# EAGLE design Stepper Test (EAGLE 9.0.0)
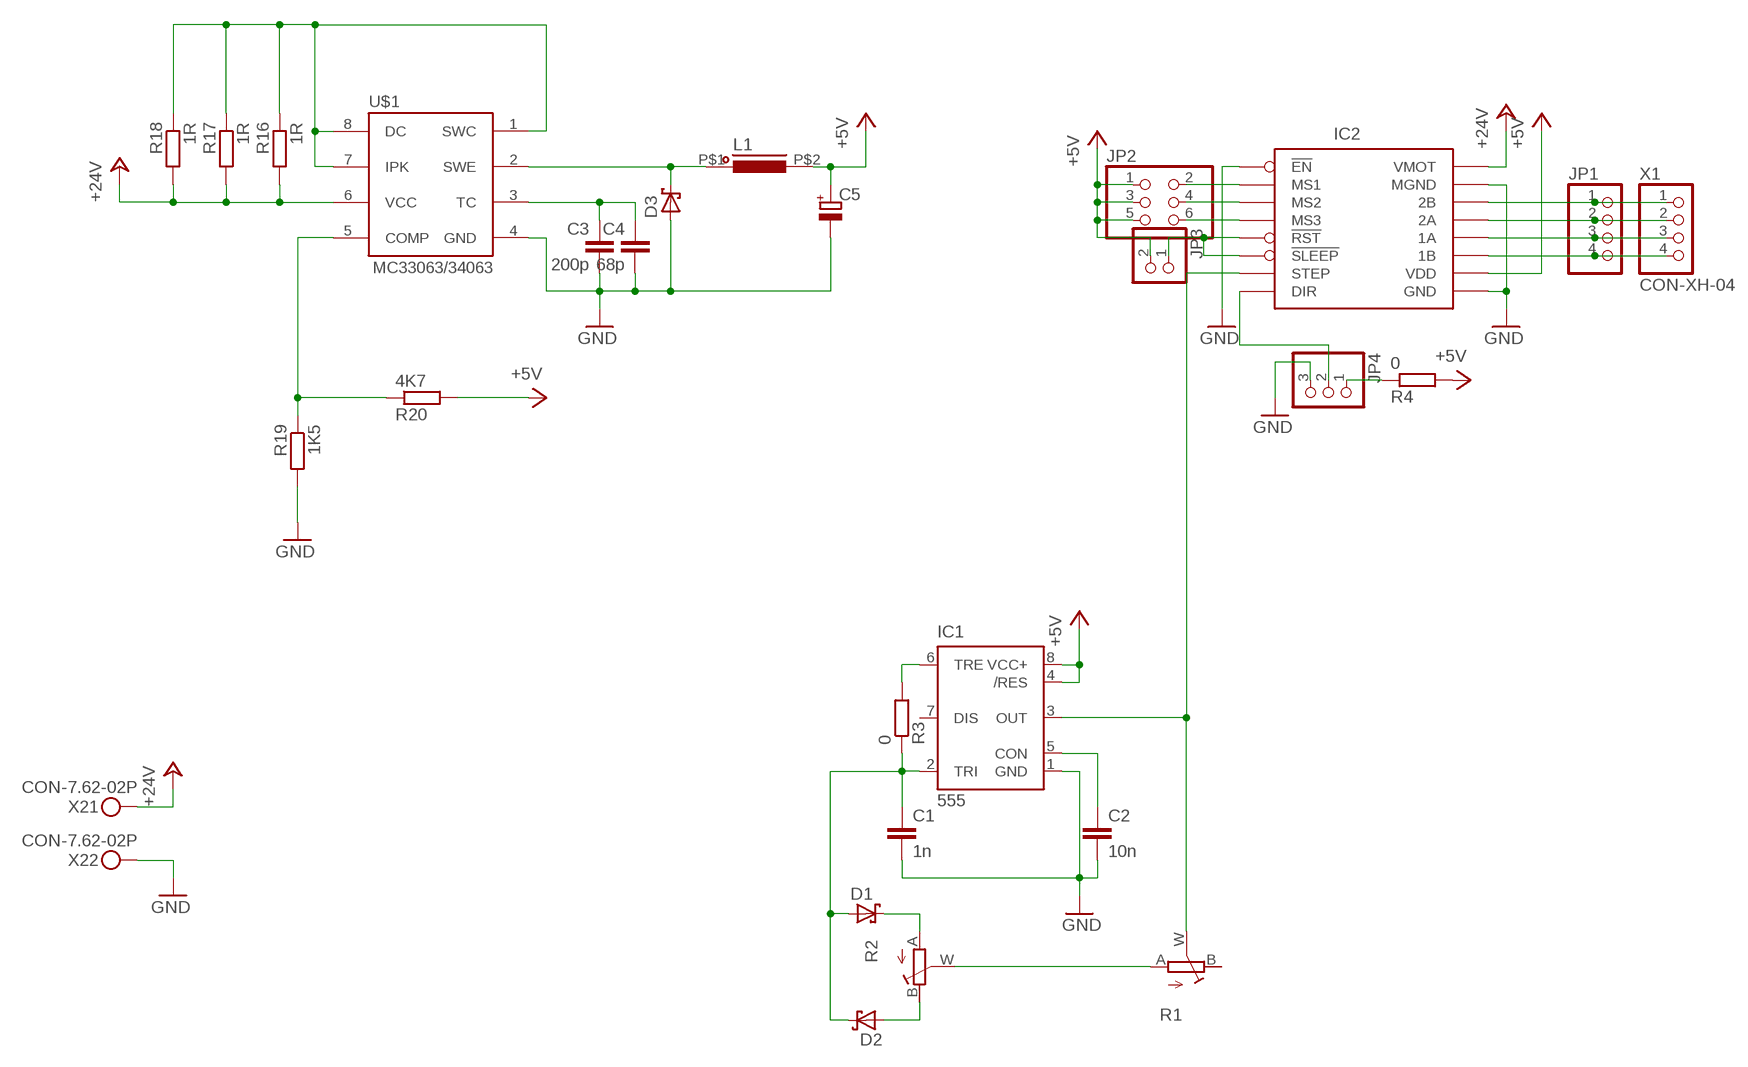
[diagram p0: schematic, sheet 1]

## Parts
C1  1n  CAP_0805  [C0805]
C2  10n  CAP_0805  [C0805]
C3  200p  CAP_0805  [C0805]
C4  68p  CAP_0805  [C0805]
C5  CAP-POL_E3.5-8  [E3,5-8]
D1  DIODE-SH_SOD523  [SOD523]
D2  DIODE-SH_SOD523  [SOD523]
D3  DIODE-SH_SMA  [DO214AC]
IC1  555  555D  [SO08]
IC2  STEP-DRV  [DRV-BRK]
JP1  PINHD-1X4  [1X04]
JP2  PINHD-2X3  [2X03]
JP3  PINHD-1X2  [1X02]
JP4  PINHD-1X3  [1X03]
L1  INDUCTORCW68  [CW68]
R1  R_POTTURN-X  [RJ9W]
R2  R_POTTURN-X  [RJ9W]
R3  0  R_0805  [R0805]
R4  0  R_0805  [R0805]
R16  1R  R_0805  [R0805]
R17  1R  R_0805  [R0805]
R18  1R  R_0805  [R0805]
R19  1K5  R_0805  [R0805]
R20  4K7  R_0805  [R0805]
U$1  MC33063/MC34063P  [DIL08]
X1  CON-XH-04  [XH-04]
X2  CON-7.62-02P  [KF25C-7.62-02P-13]

## Nets
+5V: C5.+ IC1.4(/RES) IC1.8(VCC+) IC2.P$10(VDD) JP2.1 JP2.3 JP2.5 JP3.2 L1.P$2 R4.2 R20.2
+24V: IC2.P$16(VMOT) R16.2 R17.2 R18.2 U$1.6(VCC) X2.P$1
GND: C1.2 C2.2 C3.2 C4.2 C5.- D3.A IC1.1(GND) IC2.P$1(!EN) IC2.P$9(GND) IC2.P$15(MGND) JP4.3 R19.2 U$1.4(GND) X2.P$2
N$1: C1.1 D1.A D2.C IC1.2(TRI) R3.1
N$2: IC2.P$14(2B) JP1.1 X1.1
N$3: C2.1 IC1.5(CON)
N$4: IC2.P$13(2A) JP1.2 X1.2
N$5: IC2.P$12(1A) JP1.3 X1.3
N$6: IC2.P$11(1B) JP1.4 X1.4
N$7: IC2.P$2(MS1) JP2.2
N$8: IC2.P$3(MS2) JP2.4
N$9: R1.A R2.W(S)
N$10: IC1.3(OUT) IC2.P$7(STEP) R1.W(S)
N$11: D1.C R2.A
N$12: D2.A R2.B(E)
N$13: IC2.P$4(MS3) JP2.6
N$14: IC2.P$5(!RST) IC2.P$6(!SLEEP) JP3.1
N$15: IC1.6(TRE) R3.2
N$16: IC2.P$8(DIR) JP4.2
N$17: JP4.1 R4.1
N$51: C3.1 C4.1 U$1.3(TC)
N$52: R16.1 R17.1 R18.1 U$1.1(SWC) U$1.7(IPK) U$1.8(DC)
N$54: D3.C L1.P$1 U$1.2(SWE)
N$55: R19.1 R20.1 U$1.5(COMP)
Unconnected: IC1.7(DIS) R1.B(E)

## Library data of the parts
C1 C2 = Flamberm:CAP_
C3 C4 = Namenlos:CAP_
C5 = Namenlos:CAP-POL_
D1 D2 = Flamberm:DIODE-SH_
D3 = Namenlos:DIODE-SH_
IC1 = SparkFun-IC-Special-Function:555: General purpose bipolar Timer Datasheet <http://www.sparkfun.com/datasheets/Components/General/ne555.pdf> SparkFun Products SparkFun SparkPunk Sequencer Kit <https://www.sparkfun.com/products/12707> (KIT-12707) Storefront Component: 555 Timer <https://www.sparkfun.com/products/9273> (COM-09273) Two parts valid for production: VFP: IC-11930 (M7555 PTH) VFP: IC-09173 (555 PTH) - Preferred; PROD_ID: NA-XXXXX
IC2 = Flamberm:STEP-DRV
JP1 = pinhead:PINHD-1X4: PIN HEADER
JP2 = pinhead:PINHD-2X3: PIN HEADER
JP3 = pinhead:PINHD-1X2: PIN HEADER
JP4 = pinhead:PINHD-1X3: PIN HEADER
L1 = Namenlos:INDUCTOR
R1 R2 = Flamberm:R_POT
R3 R4 R16-R20 = Namenlos:R_
U$1 = adafruit:MC33063/MC34063: MC33063 and MC34063 Basic DC/DC converter with internal power-NPN transistor, 100KHz, 1.5A peak switch current. 3-40 input/output.
X1 = Flamberm:CON-XH-04
X2 = Flamberm:CON-7.62-02P

## Board
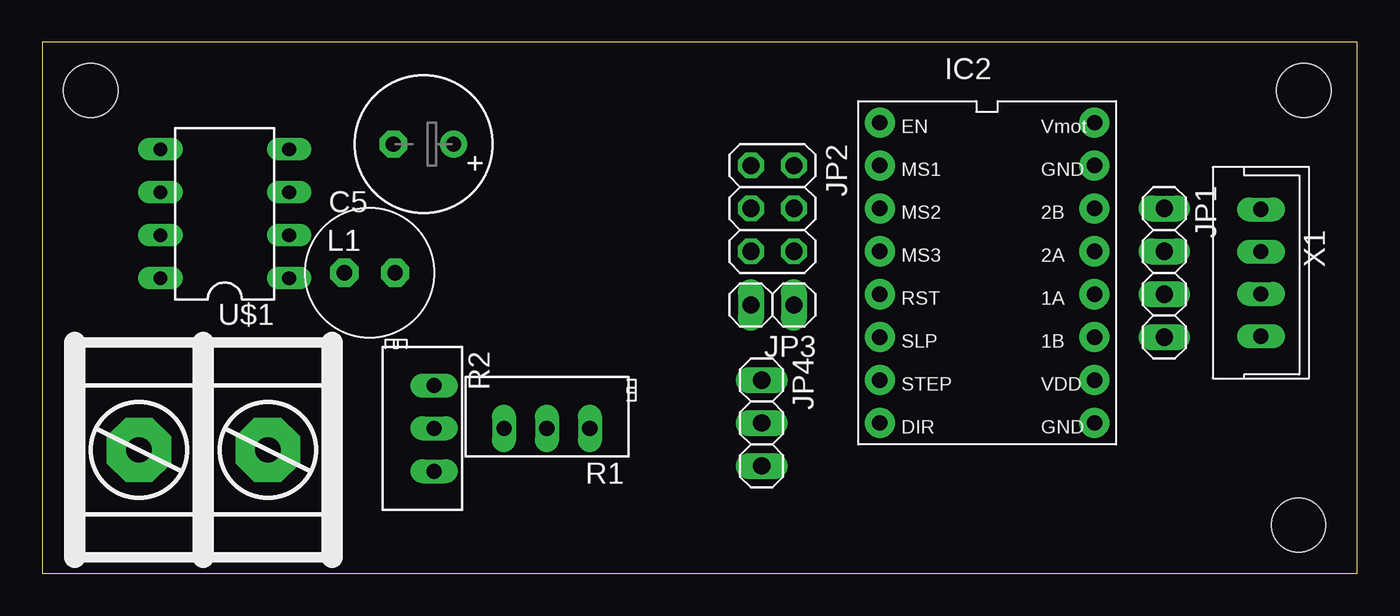
[diagram p1: board, top side]
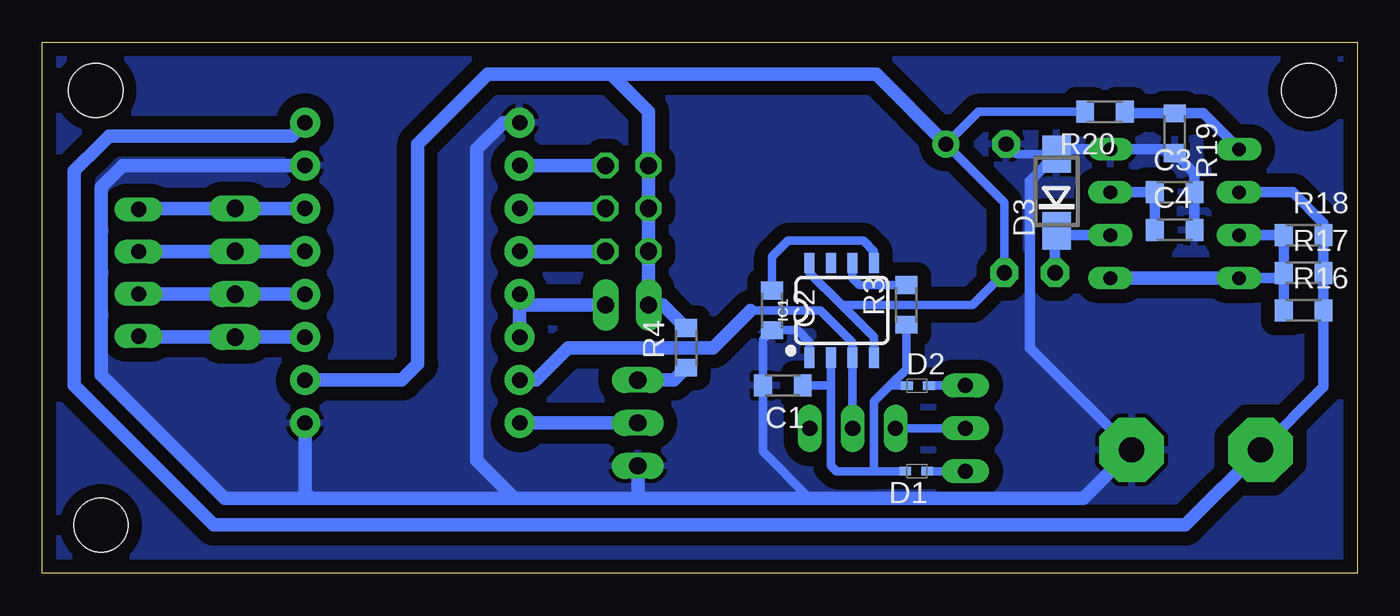
[diagram p2: board, bottom side, seen from below]

Size 77.77 x 31.42 mm. Coordinates in mm from the lower left corner, seen from the top.
Outline: 0,0 77.77,0 77.77,31.42 0,31.42 0,0
Copper layers (1*16): Top 0.035mm / dielectric 1.5mm / Bottom 0.035mm
Design rules "EagleDesignRules": minimum track width 0.25mm, minimum drill 0.3mm, track to track 0.25mm, track to pad 0.25mm, pad to pad 0.25mm, via to via 0.25mm, smd to smd 0.25mm, copper to edge 0.5mm, drill to drill 0.5mm, minimum pad ring 10mil, minimum via ring 8mil, stop-mask expansion 4mil, vias tented up to drill 0mil, thermal gap 0.25mm
Holes 3.2 mm at 74.61,28.57 2.86,28.57 74.3,2.86

### Footprints (pad centres in the part's own frame; a part is rotated, then mirrored left to right if it is on the bottom)
C0805 = smd 1.05 x 1.3: 1 -1.175,0; 2 1.175,0
E3,5-8 = drill 0.9 pad 1.6: + -1.778,0 | drill 0.9 pad 1.6 octagon: - 1.778,0
SOD523 = smd 0.7 x 0.5: A 0.7,0; C -0.6,0
DO214AC = smd 2.2 x 1.7: A 2.25,0; C -2.285,0
SO08 = smd 0.6 x 1.2: 1 -1.905,-2.8; 2 -0.635,-2.8; 3 0.635,-2.8; 4 1.905,-2.8; 5 1.905,2.8; 6 0.635,2.8; 7 -0.635,2.8; 8 -1.905,2.8
DRV-BRK = drill 0.9 pad 1.778: P$1 -8.89,-6.35; P$2 -6.35,-6.35; P$3 -3.81,-6.35; P$4 -1.27,-6.35; P$5 1.27,-6.35; P$6 3.81,-6.35; P$7 6.35,-6.35; P$8 8.89,-6.35; P$9 8.89,6.35; P$10 6.35,6.35; P$11 3.81,6.35; P$12 1.27,6.35; P$13 -1.27,6.35; P$14 -3.81,6.35; P$15 -6.35,6.35; P$16 -8.89,6.35
1X04 = drill 1.016 long: 1 -3.81,0; 2 -1.27,0; 3 1.27,0; 4 3.81,0
2X03 = drill 1.016 octagon: 1 -2.54,-1.27; 2 -2.54,1.27; 3 0,-1.27; 4 0,1.27; 5 2.54,-1.27; 6 2.54,1.27
1X02 = drill 1.016 long: 1 -1.27,0; 2 1.27,0
1X03 = drill 1.016 long: 1 -2.54,0; 2 0,0; 3 2.54,0
CW68 = drill 0.9 pad 1.676 octagon: P$1 -1.5,0; P$2 1.5,0
RJ9W = drill 0.9 long: A 2.54,0.635; B -2.54,0.635; W 0,0.635
R0805 = smd 1.05 x 1.3: 1 -1.175,0; 2 1.175,0
DIL08 = drill 0.813 long: 1 -3.81,-3.81; 2 -1.27,-3.81; 3 1.27,-3.81; 4 3.81,-3.81; 5 3.81,3.81; 6 1.27,3.81; 7 -1.27,3.81; 8 -3.81,3.81
XH-04 = drill 0.9 long: 1 -3.75,0; 2 -1.25,0; 3 1.25,0; 4 3.75,0
KF25C-7.62-02P-13 = drill 1.5 pad 3.81 octagon: P$1 -3.81,0; P$2 3.81,0

### Placement (x,y rotation side)
C1  33.97,11.11 180 bottom
C2  34.61,15.56 270 bottom
C3  10.79,22.54 0 bottom
C4  10.79,20.32 0 bottom
C5  22.54,25.4 180 top
D1  26.04,6.03 180 bottom
D2  26.04,11.11 0 bottom
D3  17.78,22.54 90 bottom
IC1  30.48,15.56 0 bottom
IC2  55.88,17.78 270 top
JP1  66.36,17.78 270 top
JP2  43.18,21.59 270 top
JP3  43.18,15.88 180 top
JP4  42.55,8.89 270 top
L1  19.37,17.78 0 top
R1  29.84,9.21 180 top
R2  22.54,8.57 270 top
R3  26.67,15.88 90 bottom
R4  39.69,13.34 90 bottom
R16  3.17,15.56 0 bottom
R17  3.17,17.78 0 bottom
R18  3.17,20 0 bottom
R19  10.79,26.04 270 bottom
R20  14.92,27.3 180 bottom
U$1  10.79,21.27 90 top
X1  72.07,17.78 270 top
X2  9.53,7.3 0 top

### Tracks (layer width: path | path; a pad name or v marks a point on that pad's centre or on a via)
+5V
  Bottom 0.508: R20.2 19.05,27.3 | 19.05,27.3 19.49,27.3 | 19.05,27.3 22.42,27.3 C5.+ 20.87,21.95 L1.P$2 22.77,15.88 30.48,15.88 | IC1.4 28.57,13.97 30.48,15.88 | IC1.8 32.38,17.78 30.48,15.88
  Bottom 0.813: IC2.P$10 56.52,11.43 55.56,12.38 55.56,25.4 51.44,29.53 44.13,29.53 | 44.13,29.53 41.91,27.3 JP2.1 JP2.3 JP2.5 JP3.2 41.05,15.88 R4.2 | 44.13,29.53 28.45,29.53 C5.+
+24V
  Bottom 0.61: X2.P$1 2,11.02 R16.2 R17.2 R18.2 2,20.73 3.81,22.54 U$1.6
  Bottom 0.813: X2.P$1 10.16,2.86 67.63,2.86 75.88,11.11 75.88,23.81 74.3,25.4 73.82,25.88 63.02,25.88 IC2.P$16
GND
  Bottom 0.508: IC1.1 32.38,13.65 33.12,14.38 33.34,14.38 C2.2 35.15,13.84 C1.2 35.15,7.21 32.38,4.45 | C5.- 20.16,24.79 D3.A
  Bottom 0.61: C4.2 C3.2 9.62,23.68 R19.2 11.02,25.08 U$1.4 17.49,25.08 D3.A 19.37,23.2 19.37,13.34 X2.P$2
  Bottom 0.813: X2.P$2 16.19,4.45 32.38,4.45 42.55,4.45 | 42.55,4.45 49.85,4.45 | 49.85,4.45 52.07,6.67 52.07,25.08 50.48,26.67 IC2.P$1 | JP4.3 42.55,4.45 | IC2.P$15 73.03,24.13 74.3,22.86 74.3,11.75 66.99,4.45 61.91,4.45 | 49.85,4.45 61.91,4.45 | IC2.P$9 62.23,4.76 61.91,4.45
  pour Bottom (isolate 0.813): 0,31.43 77.79,31.43 77.79,0 0,0
N$1
  Bottom 0.508: IC1.2 31.11,11.11 | 31.11,11.11 31.11,10.89 | D1.A 28.57,6.03 | D2.C 27.62,11.11 | 27.62,11.11 28.57,10.16 28.57,6.03 | 31.11,11.11 31.11,6.35 30.8,6.03 28.57,6.03 | C1.1 31.11,11.11 | R3.1 26.67,12.06 27.62,11.11
N$2
  Bottom 0.813: X1.1 72.01,21.59 JP1.1 IC2.P$14
N$3
  Bottom 0.508: C2.1 34.61,18.73 33.66,19.68 29.21,19.68 28.57,19.05 IC1.5
N$4
  Bottom 0.813: X1.2 66.38,19.03 | 66.38,19.03 JP1.2 | IC2.P$13 JP1.2 | JP1.2 66.38,19.03
N$5
  Bottom 0.813: X1.3 72.05,16.51 JP1.3 IC2.P$12
N$6
  Bottom 0.813: IC2.P$11 JP1.4 72.01,13.97 X1.4
N$7
  Bottom 0.813: JP2.2 IC2.P$2
N$8
  Bottom 0.813: IC2.P$3 JP2.4
N$9
  Bottom 0.508: R2.W R1.A
N$10
  Bottom 0.508: R1.W IC1.3 29.84,13.65 31.75,15.56 35.88,15.56
  Bottom 0.813: IC2.P$7 48.58,11.43 46.67,13.34 38.1,13.34 35.88,15.56
N$11
  Bottom 0.508: R2.A D1.C
N$12
  Bottom 0.508: R2.B D2.A
N$13
  Bottom 0.813: JP2.6 IC2.P$4
N$14
  Bottom 0.813: JP3.1 49.53,15.88 | 49.53,15.88 IC2.P$5 | IC2.P$6 49.53,15.88
N$15
  Bottom 0.508: R3.2 29.43,17.05 29.84,17.46 IC1.6
N$16
  Bottom 0.813: IC2.P$8 JP4.2
N$17
  Bottom 0.813: R4.1 40.42,11.43 JP4.1
N$51
  Bottom 0.61: C4.1 C3.1 U$1.3
N$52
  Bottom 0.61: U$1.7 R18.1 R17.1 4.4,17.73 | U$1.8 4.67,17.46 4.4,17.73 | R16.1 4.35,17.68 4.4,17.73
  Bottom 0.813: U$1.8 U$1.1
N$54
  Bottom 0.61: U$1.2 17.52,20 17.65,20.13 | 17.65,20.13 D3.C | L1.P$1 17.87,19.91 17.65,20.13
N$55
  Bottom 0.61: U$1.5 9.11,27.21 R19.1 13.65,27.21 R20.1